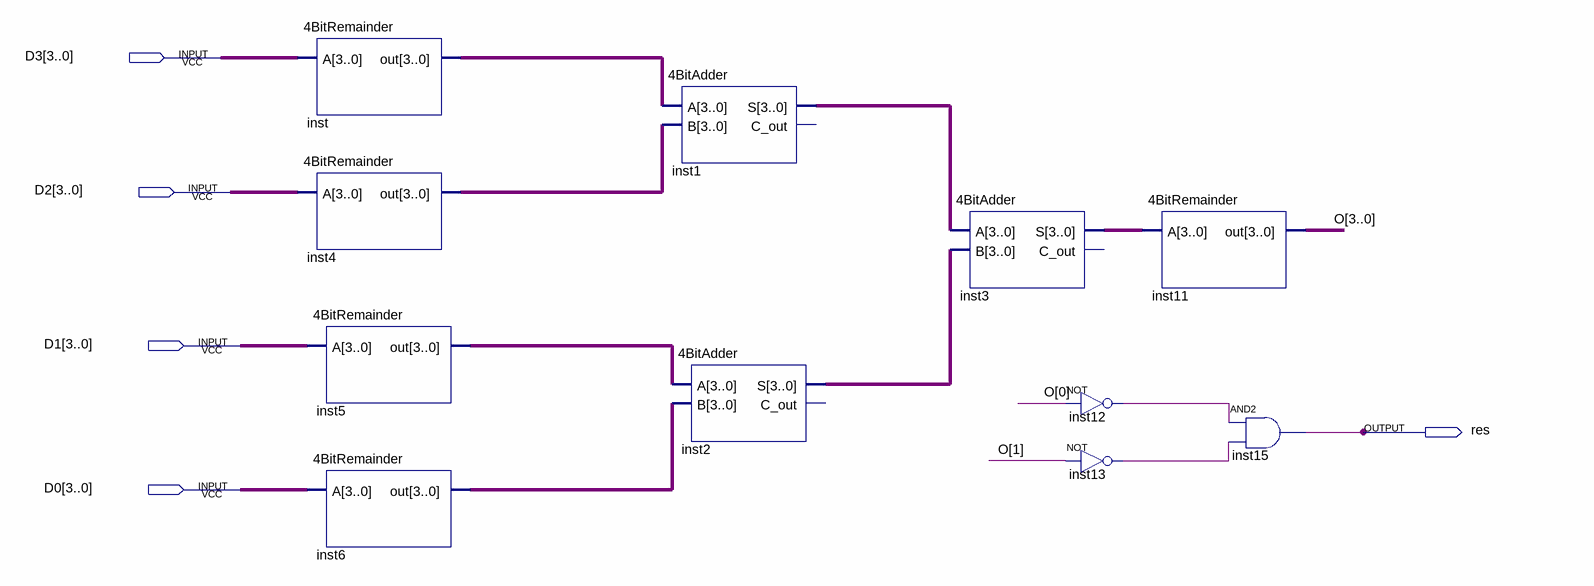
[diagram p0: schematic sheet]
// Quartus schematic 3_final.bdf as structural Verilog: 11 symbols, 5 pins
module \3_final  (
  input  [3:0] D3,
  input  [3:0] D2,
  input  [3:0] D1,
  input  [3:0] D0,
  output res
);

  wire inst12_out, inst13_out;
  wire [3:0] inst1_s, inst2_s, inst3_s, inst4_out, inst5_out, inst6_out, inst_out, O;

  \4BitRemainder  inst (.A(D3), .out(inst_out));
  \4BitRemainder  inst4 (.A(D2), .out(inst4_out));
  \4BitRemainder  inst5 (.A(D1), .out(inst5_out));
  \4BitRemainder  inst6 (.A(D0), .out(inst6_out));
  \4BitAdder  inst1 (.A(inst_out), .B(inst4_out), .S(inst1_s));  // open: C_out
  \4BitAdder  inst2 (.A(inst5_out), .B(inst6_out), .S(inst2_s));  // open: C_out
  \4BitAdder  inst3 (.A(inst1_s), .B(inst2_s), .S(inst3_s));  // open: C_out
  not inst12 (inst12_out, O[0]);
  not inst13 (inst13_out, O[1]);
  \4BitRemainder  inst11 (.A(inst3_s), .out(O));
  and inst15 (res, inst12_out, inst13_out);
endmodule
